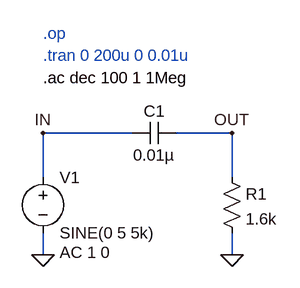
[diagram p0: schematic Schematic.asc]
Schematic.asc, the LTspice schematic file:
Version 4.1
SHEET 1 880 680
WIRE 224 16 96 16
WIRE 368 16 288 16
WIRE 96 80 96 16
WIRE 368 80 368 16
WIRE 96 192 96 160
WIRE 368 192 368 160
FLAG 96 192 0
FLAG 368 192 0
FLAG 96 16 IN
FLAG 368 16 OUT
SYMBOL voltage 96 64 R0
WINDOW 123 24 124 Left 2
WINDOW 39 0 0 Left 0
SYMATTR Value2 AC 1 0
SYMATTR InstName V1
SYMATTR Value SINE(0 5 5k)
SYMBOL cap 288 0 R90
WINDOW 0 0 32 VBottom 2
WINDOW 3 32 32 VTop 2
SYMATTR InstName C1
SYMATTR Value 0.01µ
SYMBOL res 352 64 R0
SYMATTR InstName R1
SYMATTR Value 1.6k
TEXT 96 -64 Left 2 !.ac dec 100 1 1Meg
TEXT 96 -96 Left 2 ;.tran 0 200u 0 0.01u
TEXT 96 -128 Left 2 ;.op

The netlist it stands for:
* Schematic.asc
V1 IN 0 SINE(0 5 5k) AC 1 0
C1 OUT IN 0.01µ
R1 OUT 0 1.6k
.ac dec 100 1 1Meg
* .tran 0 200u 0 0.01u
* .op
.backanno
.end